# EAGLE design pitch_pause_led (EAGLE 6.4)
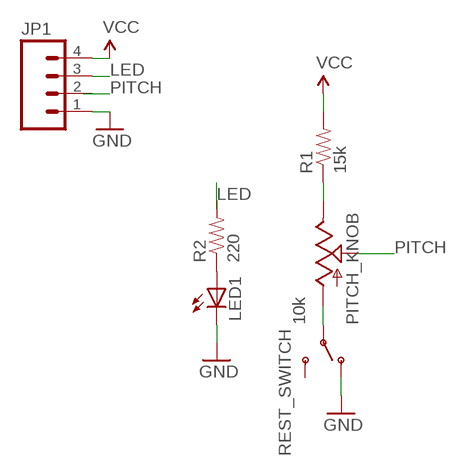
[diagram p0: schematic, sheet 1]

## Parts
JP1  M04JST-PTH  [JST-4-PTH]
LED1  LED-3MM-NO_SILK  [LED3MM-NS]
PITCH_KNOB  10k  SPARKFUN_POTPDB12  [SPARKFUN_PDB12]
R1  15k  RESISTORAXIAL-0.3  [AXIAL-0.3]
R2  220  RESISTORAXIAL-0.3  [AXIAL-0.3]
REST_SWITCH  SWITCH-SPDTPTH_LOCK  [SWITCH-SPDT_LOCK.007S]

## Nets
GND: JP1.1 LED1.K(C) REST_SWITCH.1(O)
LED: JP1.3 R2.P$2
N$1: PITCH_KNOB.1(A) REST_SWITCH.2(P)
N$2: PITCH_KNOB.3(E) R1.P$1
N$4: LED1.A R2.P$1
PITCH: PITCH_KNOB.2(S)
VCC: JP1.4 R1.P$2
Unconnected: JP1.2 REST_SWITCH.3(S)

## Library data of the parts
JP1 = SparkFun-Connectors:M04: Header 4 Standard 4-pin 0.1" header. Use with straight break away headers (SKU : PRT-00116), right angle break away headers (PRT-00553), swiss pins (PRT-00743), machine pins (PRT-00117), and female headers (PRT-00115). Molex polarized connector foot print use with SKU : PRT-08231 with associated crimp pins and housings. 1MM SMD Version SKU: PRT-10208
LED1 = SparkFun-LED:LED: LEDs Standard schematic elements and footprints for 5mm, 3mm, 1206, and 0603 sized LEDs. 5mm - Spark Fun Electronics SKU : COM-00529 (and others)
PITCH_KNOB = DCO_PIGGY:SPARKFUN_POT
R1 R2 = SparkFun-Passives:RESISTOR: Resistor Basic schematic elements and footprints for 0603, 1206, and PTH resistors.
REST_SWITCH = SparkFun-Electromechanical:SWITCH-SPDT: SPDT Switch Simple slide switch, Spark Fun Electronics SKU : COM-00102 DPDT SMT slide switch, AYZ0202, SWCH-08179

## Board
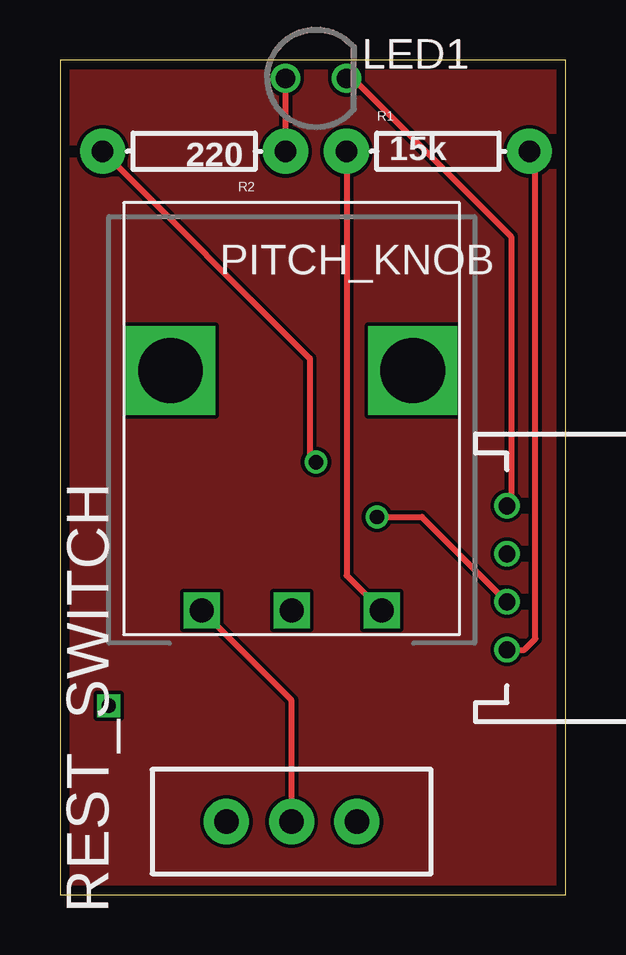
[diagram p1: board, top side]
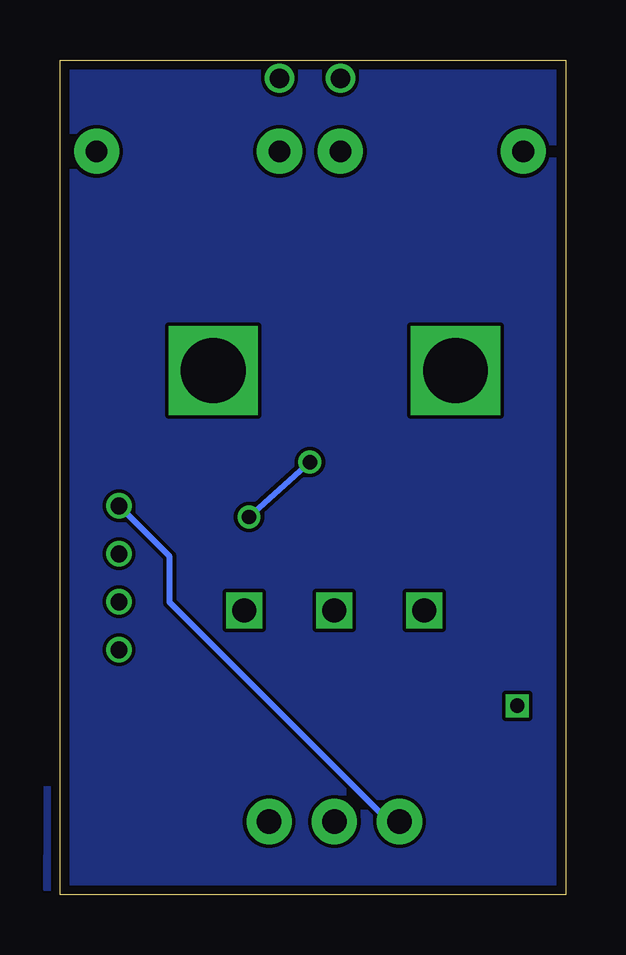
[diagram p2: board, bottom side, seen from below]

Size 21.08 x 34.8 mm. Coordinates in mm from the lower left corner, seen from the top.
Outline: 0,0 21.08,0 21.08,34.8 0,34.8 0,0
Copper layers (1*16): Top 0.0356mm / dielectric 1.5011mm / Bottom 0.0356mm
Design rules "LaenPCBOrder": minimum track width 6mil, minimum drill 13mil, track to track 6mil, track to pad 6mil, pad to pad 6mil, via to via 6mil, smd to smd 6mil, copper to edge 15mil, drill to drill 6mil, minimum pad ring 7mil, minimum via ring 7mil, stop-mask expansion 3mil, vias tented up to drill 0mil, thermal gap 10mil

### Footprints (pad centres in the part's own frame; a part is rotated, then mirrored left to right if it is on the bottom)
JST-4-PTH = drill 0.7: 1 -3,-5; 2 -1,-5; 3 1,-5; 4 3,-5
LED3MM-NS = drill 0.813: A -1.27,0; K 1.27,0
SPARKFUN_PDB12 = drill 1 square: 1 -3.75,-10; 2 0,-10; 3 3.75,-10 | drill 2.7 square: P$4 5.05,0; P$5 -5.05,0
AXIAL-0.3 = drill 0.9 pad 1.88: P$1 -3.81,0; P$2 3.81,0
SWITCH-SPDT_LOCK.007S = drill 1.016 pad 1.88: 1 0,2.718; 2 0,0; 3 0,-2.718

### Placement (x,y rotation side)
JP1  23.62,13.21 270 top
LED1  10.67,34.04 0 top
PITCH_KNOB  9.65,21.84 0 top
R1  15.75,30.99 0 top
R2  5.59,30.99 180 top
REST_SWITCH  9.65,3.05 90 top

### Tracks (layer width: path | path; a pad name or v marks a point on that pad's centre or on a via)
GND
  Top 0.254: JP1.1 18.8,16.38 18.8,27.43 12.19,34.04 LED1.K
  Bottom 0.254: REST_SWITCH.1 7.37,3.05 16.51,12.19 16.51,14.1 JP1.1
LED  (via drill 0.6)
  Top 0.254: R2.P$2 10.41,22.35 10.41,18.03 v10.67,18.03 | v13.21,15.75 15.08,15.75 JP1.3
  Bottom 0.254: v10.67,18.03 v13.21,15.75
N$1
  Top 0.254: REST_SWITCH.2 9.65,8.09 PITCH_KNOB.1
N$2
  Top 0.254: R1.P$1 11.94,13.31 PITCH_KNOB.3
N$3
  pour Bottom: 0.25,0.25 0,34.54 21.34,34.54 21.59,0.25
N$4
  Top 0.254: R2.P$1 LED1.A
N$5
  pour Top: 0,34.54 0.25,0.25 20.57,0.51 21.34,34.29
N$6  (via drill 0.6)
  other vias: 2.03,7.87
VCC
  Top 0.254: JP1.4 19.35,10.21 19.81,10.67 19.81,30.73 R1.P$2